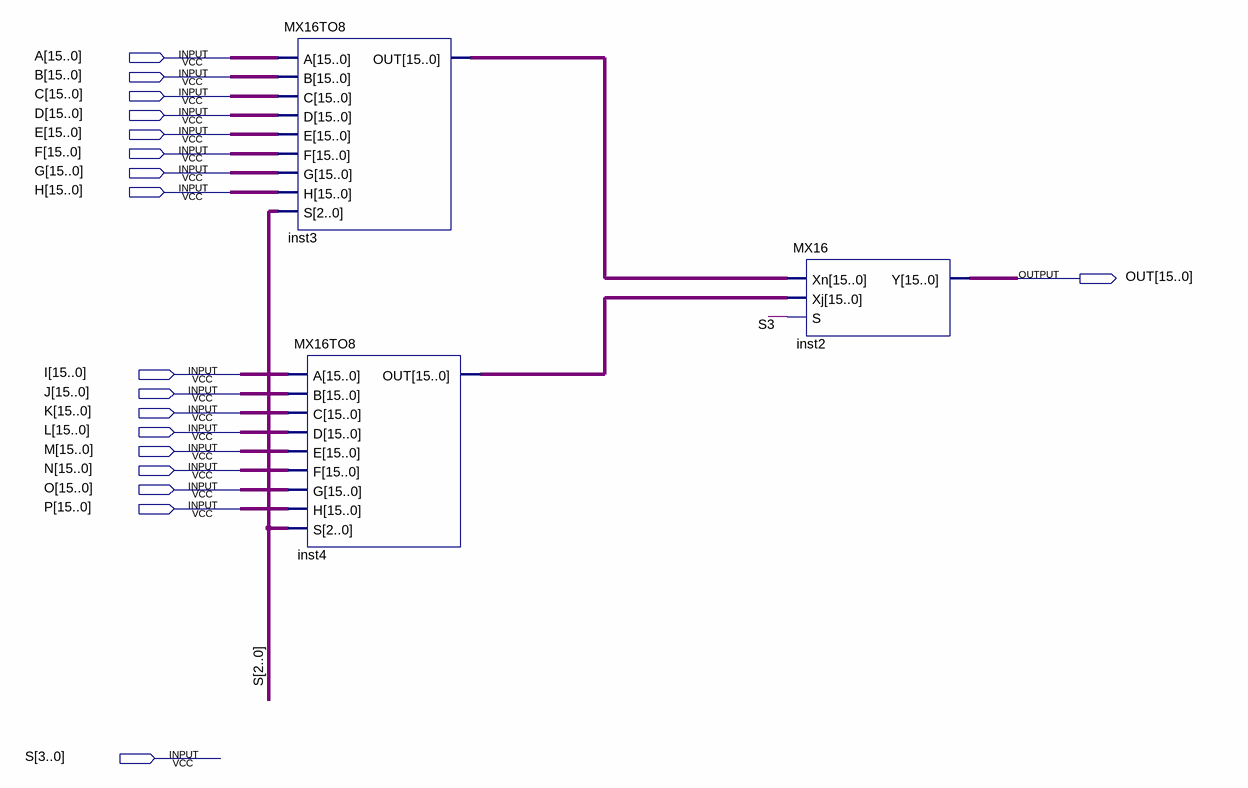
[diagram p0: schematic sheet]
// Quartus schematic MX16TO16.bdf as structural Verilog: 3 symbols, 18 pins
module MX16TO16 (
  input  [15:0] A,
  input  [15:0] B,
  input  [15:0] C,
  input  [15:0] D,
  input  [15:0] E,
  input  [15:0] F,
  input  [15:0] G,
  input  [15:0] H,
  input  [15:0] I,
  input  [15:0] J,
  input  [15:0] K,
  input  [15:0] L,
  input  [15:0] M,
  input  [15:0] N,
  input  [15:0] O,
  input  [15:0] P,
  input  [3:0] S,
  output [15:0] OUT
);

  wire [15:0] inst3_out, inst4_out;

  MX16TO8 inst3 (.A(A), .B(B), .C(C), .D(D), .E(E), .F(F), .G(G), .H(H), .S(S[2:0]), .OUT(inst3_out));
  MX16TO8 inst4 (.A(I), .B(J), .C(K), .D(L), .E(M), .F(N), .G(O), .H(P), .S(S[2:0]), .OUT(inst4_out));
  MX16 inst2 (.Xn(inst3_out), .Xj(inst4_out), .S(S[3]), .Y(OUT));
endmodule
